# Altium schematic sheet SunS_fixture_EGSE_Connectors.SchDoc: Connectors
size A1; Author: Michał Gumiela; ProjectName: SunS
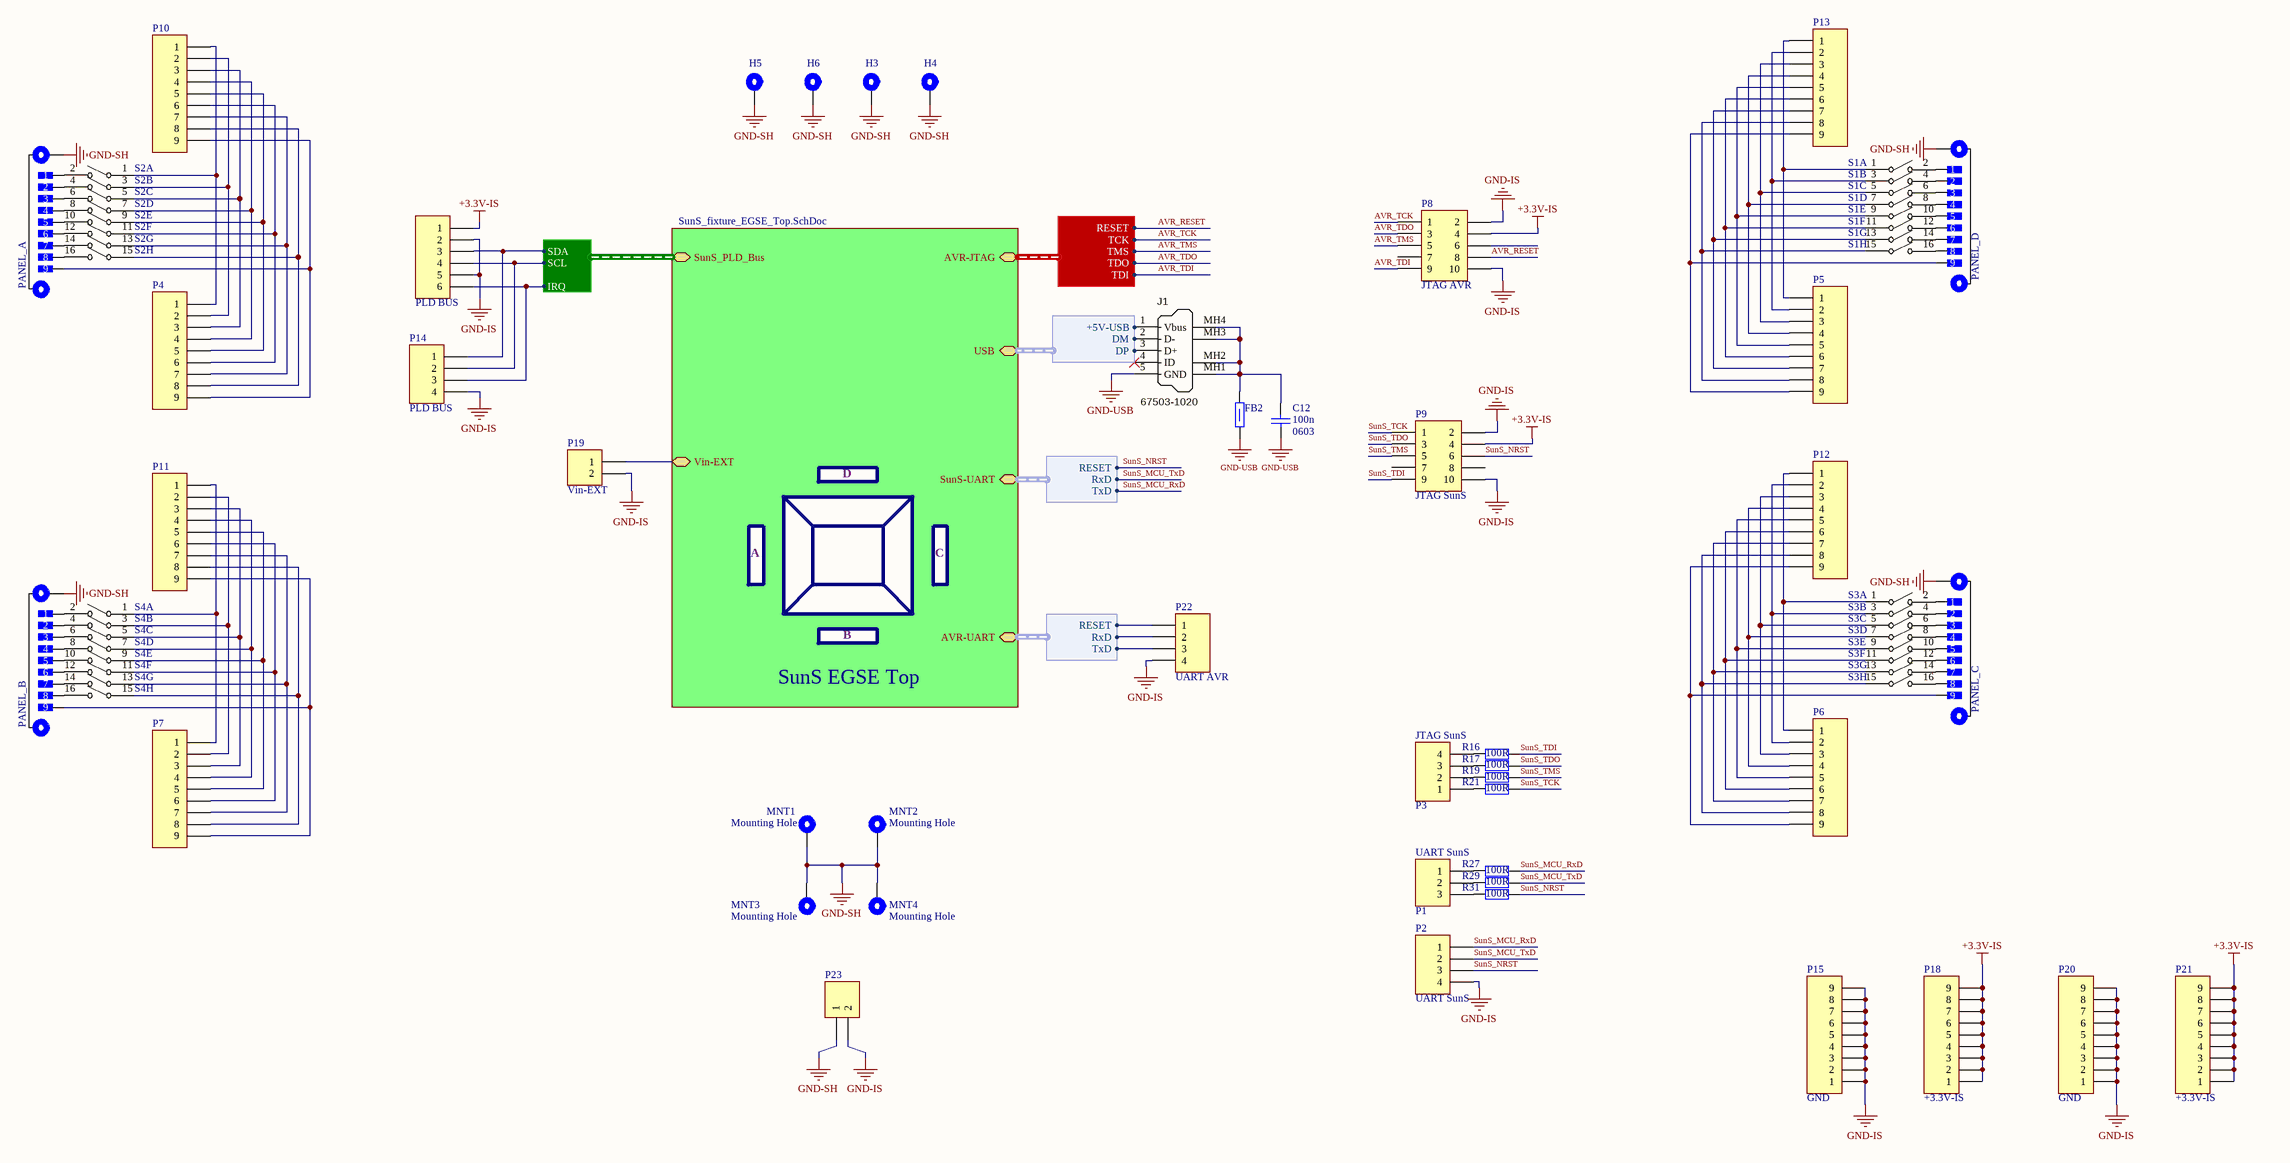
[diagram p0: SunS_fixture_EGSE_Connectors.SchDoc]

## Parts
C12  value 100n  Package: 0603  [SMD_Capacitor_0603]  (hidden comment: Cap)
FB2  120R/100MHz  [SMD_FerriteBead_1206]  (value not drawn)
H3  Mounting Hole  [SunS_PcbMntHole_M2]  (value not drawn)
H4  Mounting Hole  [SunS_PcbMntHole_M2]  (value not drawn)
H5  Mounting Hole  [SunS_PcbMntHole_M2]  (value not drawn)
H6  Mounting Hole  [SunS_PcbMntHole_M2]  (value not drawn)
J1  Manufacturer Part Number 1: 67503-1020  [USB_Mini-B_Molex_SMT]  (hidden comment: USB_Mini-B)
MNT1  Mounting Hole  [PC-104_PcbMntHole_M3]
MNT2  Mounting Hole  [PC-104_PcbMntHole_M3]
MNT3  Mounting Hole  [PC-104_PcbMntHole_M3]
MNT4  Mounting Hole  [PC-104_PcbMntHole_M3]
P1  UART SunS  [Mill-Max 854-22-003-10-001101]
P2  UART SunS  [HEADER 1x4 MALE]
P3  JTAG SunS  [Mill-Max 854-22-004-10-001101]
P4  Mill-Max 854-22-009-10-001101  [Mill-Max 854-22-009-10-001101]  (value not drawn)
P5  Mill-Max 854-22-009-10-001101  [Mill-Max 854-22-009-10-001101]  (value not drawn)
P6  Mill-Max 854-22-009-10-001101  [Mill-Max 854-22-009-10-001101]  (value not drawn)
P7  Mill-Max 854-22-009-10-001101  [Mill-Max 854-22-009-10-001101]  (value not drawn)
P8  JTAG AVR  [IDC-10-Male-Socket]
P9  JTAG SunS  [IDC-10-Male-Socket]
P10  Header 9  [HEADER 1x9 MALE]  (value not drawn)
P11  Header 9  [HEADER 1x9 MALE]  (value not drawn)
P12  Header 9  [HEADER 1x9 MALE]  (value not drawn)
P13  Header 9  [HEADER 1x9 MALE]  (value not drawn)
P14  PLD BUS  [HEADER 1x4 MALE]
P15  GND  [HEADER 1x9 MALE]
P18  +3.3V-IS  [HEADER 1x9 MALE]
P19  Vin-EXT  [HEADER 1X2H Male]
P20  GND  [HEADER 1x9 MALE]
P21  +3.3V-IS  [HEADER 1x9 MALE]
P22  UART AVR  [HEADER 1x4 MALE]
P23  Header 2  [HEADER 1X2 Male]  (value not drawn)
PANEL_A  fixture_ALS_9_pad_1mm_pitch  [fixture_ALS_9_pad_1mm_pitch]  (value not drawn)
PANEL_B  fixture_ALS_9_pad_1mm_pitch  [fixture_ALS_9_pad_1mm_pitch]  (value not drawn)
PANEL_C  fixture_ALS_9_pad_1mm_pitch  [fixture_ALS_9_pad_1mm_pitch]  (value not drawn)
PANEL_D  fixture_ALS_9_pad_1mm_pitch  [fixture_ALS_9_pad_1mm_pitch]  (value not drawn)
PLD_BUS  Mill-Max 854-22-006-10-001101  [Mill-Max 854-22-006-10-001101]  (value not drawn)
R16  100R  [SMD_Resistor_0603]
R17  100R  [SMD_Resistor_0603]
R19  100R  [SMD_Resistor_0603]
R21  100R  [SMD_Resistor_0603]
R27  100R  [SMD_Resistor_0603]
R29  100R  [SMD_Resistor_0603]
R31  100R  [SMD_Resistor_0603]
S1  MCEPM-08  [MCEPM-08]  (value not drawn)  (parts A,B,C,D,E,F,G,H of 8)
S2  MCEPM-08  [MCEPM-08]  (value not drawn)  (parts A,B,C,D,E,F,G,H of 8)
S3  MCEPM-08  [MCEPM-08]  (value not drawn)  (parts A,B,C,D,E,F,G,H of 8)
S4  MCEPM-08  [MCEPM-08]  (value not drawn)  (parts A,B,C,D,E,F,G,H of 8)

## Sub-sheets
SunS EGSE Top = SunS_fixture_EGSE_Top.SchDoc: SunS_PLD_Bus (harness SunS_PLD_Bus), AVR-JTAG (harness JTAG), USB (harness USB), SunS-UART (harness UART), Vin-EXT, AVR-UART (harness UART)

## Harnesses
SunS_PLD_Bus: SCL, SDA, IRQ
JTAG: TDO, TDI, TMS, TCK, RESET
USB: DM, DP, +5V-USB
UART: TxD, RxD, RESET

## Nets
+3.3V-IS: P8.4 P9.4 P18.1 P18.2 P18.3 P18.4 P18.5 P18.6 P18.7 P18.8 P18.9 P21.1 P21.2 P21.3 P21.4 P21.5 P21.6 P21.7 P21.8 P21.9 PLD_BUS.1
GND-IS: P2.4 P8.2 P8.10 P9.2 P9.10 P14.4 P15.1 P15.2 P15.3 P15.4 P15.5 P15.6 P15.7 P15.8 P15.9 P19.2 P20.1 P20.2 P20.3 P20.4 P20.5 P20.6 P20.7 P20.8 P20.9 P22.4 P23.2 PLD_BUS.2 PLD_BUS.5
GND-SH: H3.1 H4.1 H5.1 H6.1 MNT1.1 MNT2.1 MNT3.1 MNT4.1 P23.1 PANEL_A.0 PANEL_B.0 PANEL_C.0 PANEL_D.0
GND-USB: C12.2 FB2.2 J1.5(GND)
AVR_RESET: P8.8 ; sheet SunS EGSE Top/AVR-JTAG.RESET
AVR_TCK: P8.1 ; sheet SunS EGSE Top/AVR-JTAG.TCK
AVR_TDI: P8.9 ; sheet SunS EGSE Top/AVR-JTAG.TDI
AVR_TDO: P8.3 ; sheet SunS EGSE Top/AVR-JTAG.TDO
AVR_TMS: P8.5 ; sheet SunS EGSE Top/AVR-JTAG.TMS
SunS_MCU_RxD: P2.1 R27.1 ; sheet SunS EGSE Top/SunS-UART.TxD
SunS_MCU_TxD: P2.2 R29.1 ; sheet SunS EGSE Top/SunS-UART.RxD
SunS_NRST: P2.3 P9.6 R31.1 ; sheet SunS EGSE Top/SunS-UART.RESET
SunS_TCK: P9.1 R21.1
SunS_TDI: P9.9 R16.1
SunS_TDO: P9.3 R17.1
SunS_TMS: P9.5 R19.1
NetC12_1: C12.1 FB2.1 J1.MH1(Shell) J1.MH2(Shell) J1.MH3(Shell) J1.MH4(Shell)
NetJ1_1: J1.1(Vbus) ; sheet SunS EGSE Top/USB.+5V-USB
NetJ1_2: J1.2(D-) ; sheet SunS EGSE Top/USB.DM
NetJ1_3: J1.3(D+) ; sheet SunS EGSE Top/USB.DP
NetP1_1: P1.1 R27.2
NetP1_2: P1.2 R29.2
NetP1_3: P1.3 R31.2
NetP3_1: P3.1 R21.2
NetP3_2: P3.2 R19.2
NetP3_3: P3.3 R17.2
NetP3_4: P3.4 R16.2
NetP4_1: P4.1 P10.1 S2.1
NetP4_2: P4.2 P10.2 S2.3
NetP4_3: P4.3 P10.3 S2.5
NetP4_4: P4.4 P10.4 S2.7
NetP4_5: P4.5 P10.5 S2.9
NetP4_6: P4.6 P10.6 S2.11
NetP4_7: P4.7 P10.7 S2.13
NetP4_8: P4.8 P10.8 S2.15
NetP4_9: P4.9 P10.9 PANEL_A.9
NetP5_1: P5.1 P13.1 S1.1
NetP5_2: P5.2 P13.2 S1.3
NetP5_3: P5.3 P13.3 S1.5
NetP5_4: P5.4 P13.4 S1.7
NetP5_5: P5.5 P13.5 S1.9
NetP5_6: P5.6 P13.6 S1.11
NetP5_7: P5.7 P13.7 S1.13
NetP5_8: P5.8 P13.8 S1.15
NetP5_9: P5.9 P13.9 PANEL_D.9
NetP6_1: P6.1 P12.1 S3.1
NetP6_2: P6.2 P12.2 S3.3
NetP6_3: P6.3 P12.3 S3.5
NetP6_4: P6.4 P12.4 S3.7
NetP6_5: P6.5 P12.5 S3.9
NetP6_6: P6.6 P12.6 S3.11
NetP6_7: P6.7 P12.7 S3.13
NetP6_8: P6.8 P12.8 S3.15
NetP6_9: P6.9 P12.9 PANEL_C.9
NetP7_1: P7.1 P11.1 S4.1
NetP7_2: P7.2 P11.2 S4.3
NetP7_3: P7.3 P11.3 S4.5
NetP7_4: P7.4 P11.4 S4.7
NetP7_5: P7.5 P11.5 S4.9
NetP7_6: P7.6 P11.6 S4.11
NetP7_7: P7.7 P11.7 S4.13
NetP7_8: P7.8 P11.8 S4.15
NetP7_9: P7.9 P11.9 PANEL_B.9
NetP14_1: P14.1 PLD_BUS.3 ; sheet SunS EGSE Top/SunS_PLD_Bus.SDA
NetP14_2: P14.2 PLD_BUS.4 ; sheet SunS EGSE Top/SunS_PLD_Bus.SCL
NetP14_3: P14.3 PLD_BUS.6 ; sheet SunS EGSE Top/SunS_PLD_Bus.IRQ
NetP19_1: P19.1 ; sheet SunS EGSE Top/Vin-EXT
NetP22_1: P22.1 ; sheet SunS EGSE Top/AVR-UART.RESET
NetP22_2: P22.2 ; sheet SunS EGSE Top/AVR-UART.RxD
NetP22_3: P22.3 ; sheet SunS EGSE Top/AVR-UART.TxD
NetPANEL_A_1: PANEL_A.1 S2.2
NetPANEL_A_2: PANEL_A.2 S2.4
NetPANEL_A_3: PANEL_A.3 S2.6
NetPANEL_A_4: PANEL_A.4 S2.8
NetPANEL_A_5: PANEL_A.5 S2.10
NetPANEL_A_6: PANEL_A.6 S2.12
NetPANEL_A_7: PANEL_A.7 S2.14
NetPANEL_A_8: PANEL_A.8 S2.16
NetPANEL_B_1: PANEL_B.1 S4.2
NetPANEL_B_2: PANEL_B.2 S4.4
NetPANEL_B_3: PANEL_B.3 S4.6
NetPANEL_B_4: PANEL_B.4 S4.8
NetPANEL_B_5: PANEL_B.5 S4.10
NetPANEL_B_6: PANEL_B.6 S4.12
NetPANEL_B_7: PANEL_B.7 S4.14
NetPANEL_B_8: PANEL_B.8 S4.16
NetPANEL_C_1: PANEL_C.1 S3.2
NetPANEL_C_2: PANEL_C.2 S3.4
NetPANEL_C_3: PANEL_C.3 S3.6
NetPANEL_C_4: PANEL_C.4 S3.8
NetPANEL_C_5: PANEL_C.5 S3.10
NetPANEL_C_6: PANEL_C.6 S3.12
NetPANEL_C_7: PANEL_C.7 S3.14
NetPANEL_C_8: PANEL_C.8 S3.16
NetPANEL_D_1: PANEL_D.1 S1.2
NetPANEL_D_2: PANEL_D.2 S1.4
NetPANEL_D_3: PANEL_D.3 S1.6
NetPANEL_D_4: PANEL_D.4 S1.8
NetPANEL_D_5: PANEL_D.5 S1.10
NetPANEL_D_6: PANEL_D.6 S1.12
NetPANEL_D_7: PANEL_D.7 S1.14
NetPANEL_D_8: PANEL_D.8 S1.16

Not connected (* = marked no-connect by the designer): J1 4(ID)*; P8 6 7; P9 7 8

## Notes on the sheet
- D
- A
- C
- B
- Title:
- Project:
- Author:
- Model:
- File name:
- Document Number:
- Checked by:
- Rev:
- Date:
- Approved by:
- Sheet:
- of

## Library data of the parts
FB2 = BLM31PG121SH1L: Ferrite bead, 1206, 0.02HM, 3.5A.; Manufacturer: Murata; Current Rating: 3.5A; Series Resistance DC: 0.02R; Package: 1206; Value: 120R/100MHz; ManufacturerPartNumber: BLM31PG121SH1L
H3-H6 MNT1-MNT4 = MntHole: PCB Mounting Hole; Value: Mounting Hole
J1 = USB_Mini-B: Connector SMD USB Type Mini-B; Manufacturer 1: Molex Connector Corporation; SCDType: undef; Package / Case: SMD; Supplier 1: Digi-Key; Supplier Part Number 1: WM5461CT-ND
P1 = Mill-Max 854-22-003-10-001101: SPRING-LOADED CONNECTORS, 854-22-003-10-001101, 1.27 mm pitch, 1x3pin, THT
P2 P22 = Header 4: Header, 4-Pin; LatestRevisionDate: 17-Jul-2002; LatestRevisionNote: Re-released for DXP Platform.; Publisher: Altium Limited
P3 = Mill-Max 854-22-004-10-001101: SPRING-LOADED CONNECTORS, 854-22-004-10-001101, 1.27 mm pitch, 1x4pin, THT.
P4-P7 = Mill-Max 854-22-009-10-001101: SPRING-LOADED CONNECTORS, 854-22-009-10-001101, 1.27 mm pitch, 1x9pin, THT.
P8 P9 = Header 5X2: Header, 5-Pin, Dual row
P10-P13 P15 P18 P20 P21 = Header 9: Header, 9-Pin; LatestRevisionDate: 17-Jul-2002; LatestRevisionNote: Re-released for DXP Platform.; Publisher: Altium Limited
P14 = Header 4x1: Header, 4-Pin; LatestRevisionDate: 17-Jul-2002; LatestRevisionNote: Re-released for DXP Platform.; Publisher: Altium Limited
P19 P23 = Header 2: Header, 2-Pin; LatestRevisionDate: 17-Jul-2002; LatestRevisionNote: Re-released for DXP Platform.; Publisher: Altium Limited
PANEL_A PANEL_B PANEL_C PANEL_D = fixture_ALS_9_pad_1mm_pitch: ALS Panel Fixture Connection; Value: fixture_ALS_9_pad_1mm_pitch
PLD_BUS = Mill-Max 854-22-006-10-001101: SPRING-LOADED CONNECTORS, 854-22-006-10-001101, 1.27 mm pitch, 1x6pin, THT.
R16 R17 R19 R21 R27 R29 R31 = Res: Value: 100R; Package: 0603
S1-S4 = MCEPM-08: Supplier 1: Farnell